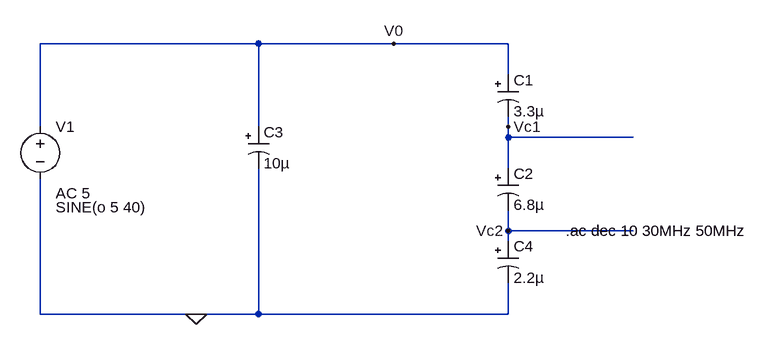
[diagram p0: schematic Capacitance- Voltage Divider.asc]
Capacitance- Voltage Divider.asc, the LTspice schematic file:
Version 4
SHEET 1 1040 680
WIRE 288 112 -48 112
WIRE 496 112 288 112
WIRE 672 112 496 112
WIRE 672 160 672 112
WIRE -48 240 -48 112
WIRE 288 240 288 112
WIRE 672 240 672 224
WIRE 672 256 672 240
WIRE 864 256 672 256
WIRE 672 304 672 256
WIRE 672 400 672 368
WIRE 864 400 672 400
WIRE 672 416 672 400
WIRE -48 528 -48 320
WIRE 192 528 -48 528
WIRE 288 528 288 304
WIRE 288 528 192 528
WIRE 672 528 672 480
WIRE 672 528 288 528
FLAG 192 528 0
FLAG 496 112 V0
FLAG 672 240 Vc1
FLAG 672 400 Vc2
SYMBOL voltage -48 224 R0
WINDOW 3 24 140 Left 2
WINDOW 123 24 118 Left 2
SYMATTR Value SINE(o 5 40)
SYMATTR Value2 AC 5
SYMATTR InstName V1
SYMATTR SpiceLine Rser=0
SYMBOL polcap 656 160 R0
WINDOW 3 24 56 Left 2
SYMATTR Value 3.3µ
SYMATTR InstName C1
SYMATTR Description Capacitor
SYMATTR Type cap
SYMATTR SpiceLine Rser=5 Lser=0 mfg="AVX" pn="TAJA335M016" type="Tantalum"
SYMBOL polcap 656 304 R0
WINDOW 3 24 56 Left 2
SYMATTR Value 6.8µ
SYMATTR InstName C2
SYMATTR Description Capacitor
SYMATTR Type cap
SYMATTR SpiceLine Rser=3 Lser=0 mfg="AVX" pn="TAJB685K010" type="Tantalum"
SYMBOL polcap 272 240 R0
WINDOW 3 24 56 Left 2
SYMATTR Value 10µ
SYMATTR InstName C3
SYMATTR Description Capacitor
SYMATTR Type cap
SYMATTR SpiceLine Rser=4 Lser=0 mfg="AVX" pn="TAJA106M006" type="Tantalum"
SYMBOL polcap 656 416 R0
WINDOW 3 24 56 Left 2
SYMATTR Value 2.2µ
SYMATTR InstName C4
SYMATTR Description Capacitor
SYMATTR Type cap
SYMATTR SpiceLine Rser=6.5 Lser=0 mfg="AVX" pn="TAJA225K016" type="Tantalum"
TEXT 760 400 Left 2 !.ac dec 10 30MHz 50MHz

The netlist it stands for:
* Capacitance- Voltage Divider.asc
V1 V0 0 SINE(o 5 40) AC 5 Rser=0
C1 V0 Vc1 3.3µ Rser=5 Lser=0 mfg="AVX" pn="TAJA335M016" type="Tantalum"
C2 Vc1 Vc2 6.8µ Rser=3 Lser=0 mfg="AVX" pn="TAJB685K010" type="Tantalum"
C3 V0 0 10µ Rser=4 Lser=0 mfg="AVX" pn="TAJA106M006" type="Tantalum"
C4 Vc2 0 2.2µ Rser=6.5 Lser=0 mfg="AVX" pn="TAJA225K016" type="Tantalum"
.ac dec 10 30MHz 50MHz
.backanno
.end